# EAGLE schematic STM32F100 Base Wireless_1 (EAGLE 6.5.0)
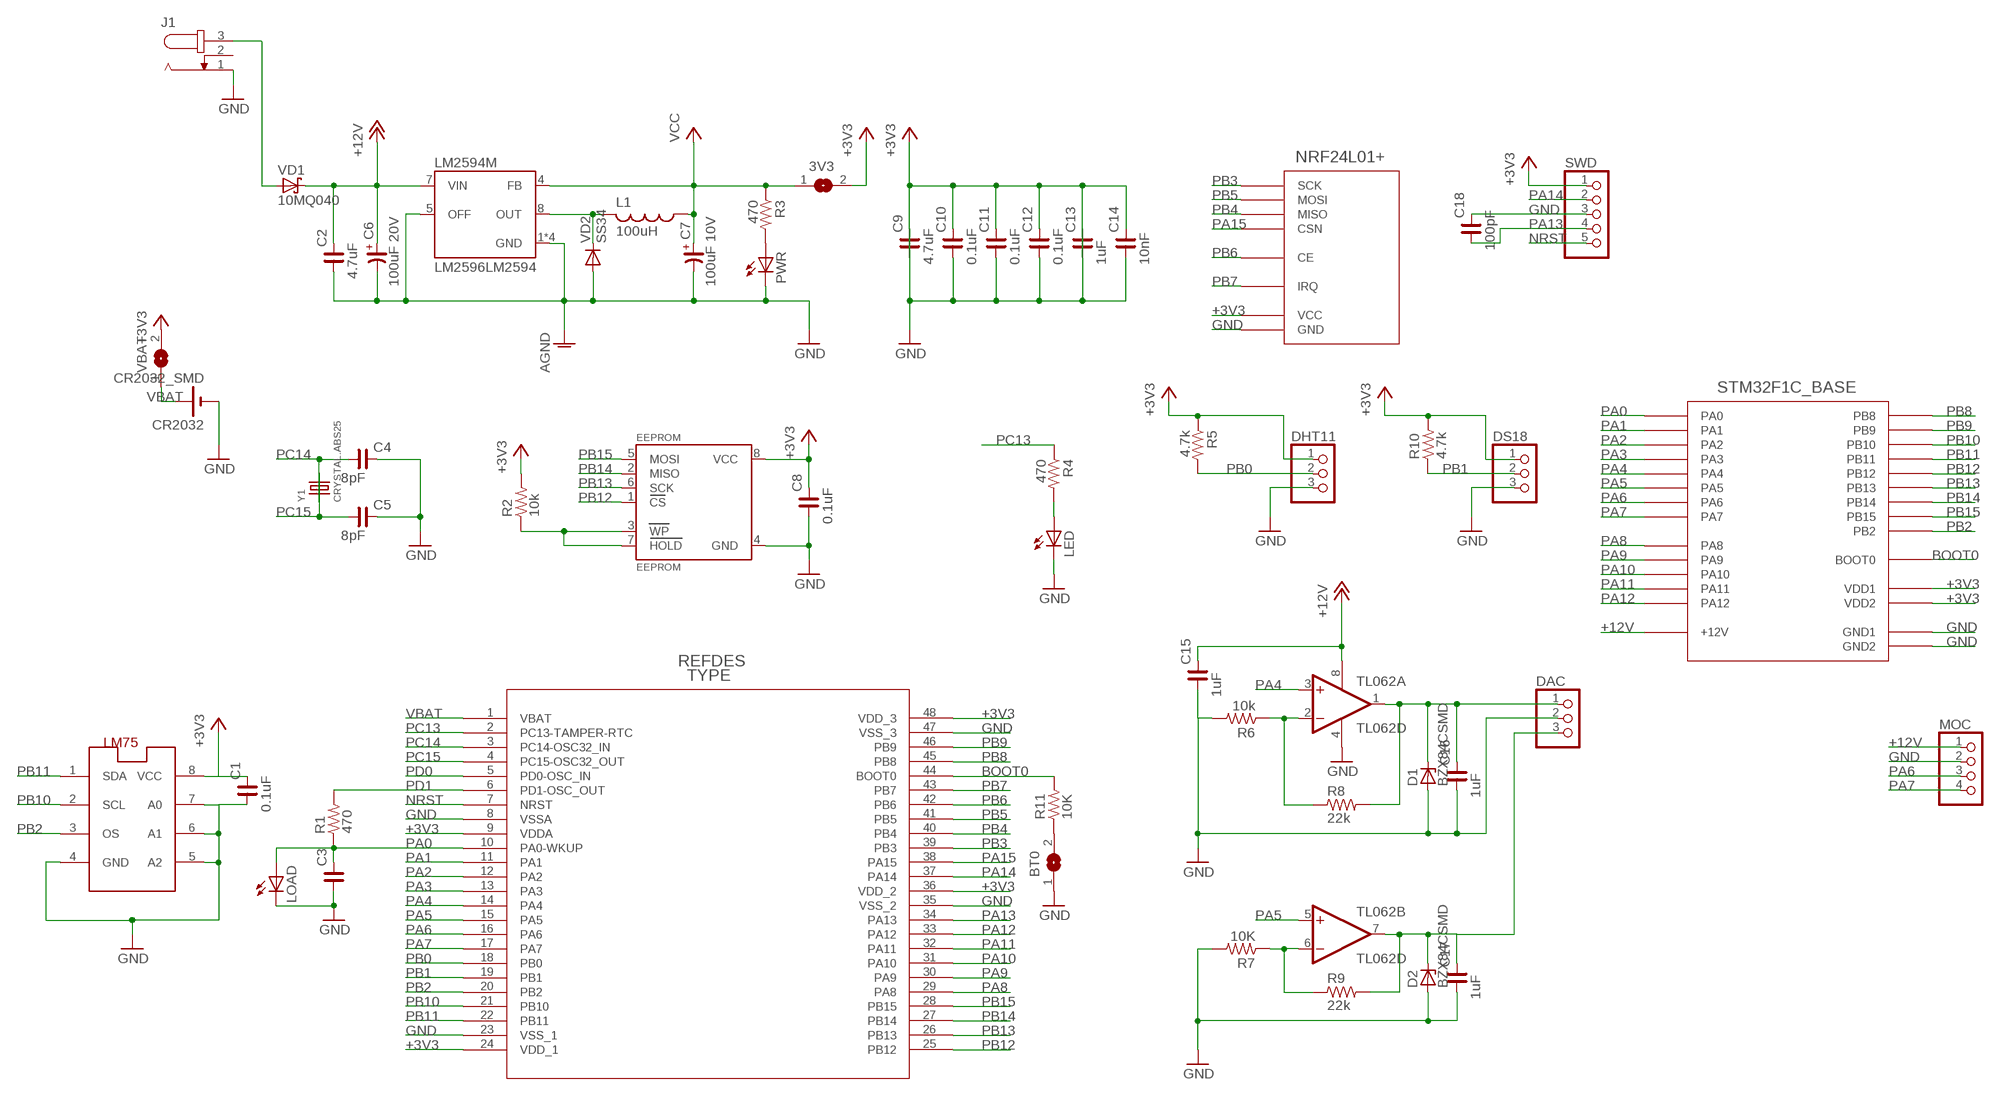
[diagram p0: schematic, sheet 1]

## Parts
3V3  SJ  [SJ]
BT0  SJ  [SJ]
C1  0.1uF  C_0603  [C0603]
C2  4.7uF  C_0603  [C0603]
C3  C_0603  [C0603]
C4  8pF  C_0603  [C0603]
C5  8pF  C_0603  [C0603]
C6  100uF 20V  CP_7343  [C7343/T]
C7  100uF 10V  CP_6032-28  [C6032-28/T]
C8  0.1uF  C_0603  [C0603]
C9  4.7uF  C_0603  [C0603]
C10  0.1uF  C_0603  [C0603]
C11  0.1uF  C_0603  [C0603]
C12  0.1uF  C_0603  [C0603]
C13  1uF  C_0603  [C0603]
C14  10nF  C_0603  [C0603]
C15  1uF  C_0603  [C0603]
C16  1uF  C_0603  [C0603]
C17  1uF  C_0603  [C0603]
C18  100pF  C_0603  [C0603]
CR2032  CR2032_SMD  [SMD_BH-2]
D1  BZX84CSMD  [TO236]
D2  BZX84CSMD  [TO236]
DAC  PINHD-1X03_2.54-S  [1X03-S]
DHT11  PINHD-1X03_2.54-S  [1X03-S]
DS18  PINHD-1X03_2.54-S  [1X03-S]
EEPROM  EEPROM  EEPROM_SPI_AT25040A  [SOIC8_150MIL]
J1  JACK-PLUG0  [SPC4077]
L1  100uH  L-USWE-TPC  [POWER-CHOKE_WE-TPC]
LED  LEDCHIPLED_1206  [CHIPLED_1206]
LM75  LM75_ICN  [SO8_LM75]
LM2594M  LM2596LM2594  [SOIC8_150MIL]
LOAD  LEDCHIPLED_1206  [CHIPLED_1206]
MOC  PINHD-1X04_2.54-S  [1X04-S]
NRF24L01+  NRF24L01+  [NRF24L01+]
PWR  LEDCHIPLED_1206  [CHIPLED_1206]
R1  470  R_1206  [R1206]
R2  10k  R_1206  [R1206]
R3  470  R_1206  [R1206]
R4  470  R_1206  [R1206]
R5  4.7k  R_1206  [R1206]
R6  10k  R_1206  [R1206]
R7  10K  R_1206  [R1206]
R8  22k  R_1206  [R1206]
R9  22k  R_1206  [R1206]
R10  4.7k  R_1206  [R1206]
R11  10K  R_1206  [R1206]
STM32F100C  STM32F100C8T6B  [LQFP-48]
SWD  PINHD-1X05_2.54-90°-S  [1X05/90-S]
TL062  TL062D  [SO08]
U$1  STM32F1C_BASE  [STM32F1_BASE]
VBAT  SJ  [SJ]
VD1  10MQ040  [SMA]
VD2  SS34  DIODE-DO214AC  [DO214AC]
Y1  CRYSTAL.ABS25  [ABS25]

## Nets
+3V3: 3V3.2 C1.2 C8.2 C9.1 C10.2 C11.2 C12.2 C13.1 C14.2 DHT11.1 DS18.1 EEPROM.8(VCC) LM75.8(VCC) NRF24L01+.VCC R2.2 R5.1 R10.2 STM32F100C.9(VDDA) STM32F100C.24(VDD_1) STM32F100C.36(VDD_2) STM32F100C.48(VDD_3) SWD.1 U$1.3.3(VDD1) U$1.3.3_1(VDD2) VBAT.2
+12V: C2.2 C6.+ C15.2 LM2594M.7(VIN) MOC.1 TL062.8(P:V+) U$1.+12(+12V) VD1.C
BOOT0: R11.2 STM32F100C.44(BOOT0) U$1.BOOT0
GND: BT0.1 C1.1 C2.1 C3.1 C4.2 C5.2 C6.- C7.- C8.1 C9.2 C10.1 C11.1 C12.1 C13.2 C14.1 C15.1 C16.1 C17.1 C18.2 CR2032.P$NEG(-) D1.A D2.A DAC.2 DHT11.3 DS18.3 EEPROM.4(GND) J1.1 LED.C LM75.4(GND) LM75.5(A2) LM75.6(A1) LM75.7(A0) LM2594M.1(GND) LM2594M.2(GND) LM2594M.3(GND) LM2594M.5(OFF) LM2594M.6(GND) LOAD.C MOC.2 NRF24L01+.GND PWR.C R6.2 R7.2 STM32F100C.8(VSSA) STM32F100C.23(VSS_1) STM32F100C.35(VSS_2) STM32F100C.47(VSS_3) SWD.3 TL062.4(P:V-) U$1.GND1(GND2) U$1.GND(GND1) VD2.A ; supply symbol labelled AGND
IN_12V: J1.3 VD1.A
LM_OUT: L1.2 LM2594M.8(OUT) VD2.C
LM_VCC: 3V3.1 C7.+ L1.1 LM2594M.4(FB) R3.1 ; supply symbol labelled VCC
N$1: C16.2 D1.C DAC.1 R8.2 TL062.1(A:OUT)
N$2: PWR.A R3.2
N$3: R6.1 R8.1 TL062.2(A:-IN)
N$4: R7.1 R9.1 TL062.6(B:-IN)
N$5: C17.2 D2.C DAC.3 R9.2 TL062.7(B:OUT)
N$6: LED.A R4.2
N$7: BT0.2 R11.1
N$10: EEPROM.3(WP) EEPROM.7(HOLD) R2.1
NRST: STM32F100C.7(NRST) SWD.5
PA0: C3.2 LOAD.A R1.1 STM32F100C.10(PA0-WKUP) U$1.PA0
PA1: STM32F100C.11(PA1) U$1.PA1
PA2: STM32F100C.12(PA2) U$1.PA2
PA3: STM32F100C.13(PA3) U$1.PA3
PA4: STM32F100C.14(PA4) TL062.3(A:+IN) U$1.PA4
PA5: STM32F100C.15(PA5) TL062.5(B:+IN) U$1.PA5
PA6: MOC.3 STM32F100C.16(PA6) U$1.PA6
PA7: MOC.4 STM32F100C.17(PA7) U$1.PA7
PA8: STM32F100C.29(PA8) U$1.PA8
PA9: STM32F100C.30(PA9) U$1.PA9
PA10: STM32F100C.31(PA10) U$1.PA10
PA11: STM32F100C.32(PA11) U$1.PA11
PA12: STM32F100C.33(PA12) U$1.PA12
PA13: C18.1 STM32F100C.34(PA13) SWD.4
PA14: STM32F100C.37(PA14) SWD.2
PA15: NRF24L01+.CSN STM32F100C.38(PA15)
PB0: DHT11.2 R5.2 STM32F100C.18(PB0)
PB1: DS18.2 R10.1 STM32F100C.19(PB1)
PB2: LM75.3(OS) STM32F100C.20(PB2) U$1.B2
PB3: NRF24L01+.SCK STM32F100C.39(PB3)
PB4: NRF24L01+.MISO STM32F100C.40(PB4)
PB5: NRF24L01+.MOSI STM32F100C.41(PB5)
PB6: NRF24L01+.CE STM32F100C.42(PB6)
PB7: NRF24L01+.IRQ STM32F100C.43(PB7)
PB8: STM32F100C.45(PB8) U$1.PB8
PB9: STM32F100C.46(PB9) U$1.PB9
PB10: LM75.2(SCL) STM32F100C.21(PB10) U$1.PB10
PB11: LM75.1(SDA) STM32F100C.22(PB11) U$1.PB11
PB12: EEPROM.1(CS) STM32F100C.25(PB12) U$1.PB12
PB13: EEPROM.6(SCK) STM32F100C.26(PB13) U$1.PB13
PB14: EEPROM.2(MISO) STM32F100C.27(PB14) U$1.PB14
PB15: EEPROM.5(MOSI) STM32F100C.28(PB15) U$1.PB15
PC13: R4.1 STM32F100C.2(PC13-TAMPER-RTC)
PC14: C4.1 STM32F100C.3(PC14-OSC32_IN) Y1.1
PC15: C5.1 STM32F100C.4(PC15-OSC32_OUT) Y1.4
PD0: STM32F100C.5(PD0-OSC_IN)
PD1: R1.2 STM32F100C.6(PD1-OSC_OUT)
VBAT: CR2032.P$POS1(+) STM32F100C.1(VBAT) VBAT.1
Unconnected: J1.2

## Library data of the parts
3V3 BT0 VBAT = jumper:SJ: SMD solder JUMPER
C1-C5 C8-C18 = rc-master-smd:C_: NON-POLARIZED CAP
C6 C7 = rc-master-smd:CP_: POLARIZED CAP
CR2032 = my-library:CR2032_SMD
D1 D2 = diode:BZX84CSMD: Z DIODE
DAC DHT11 DS18 = pinhead-2:PINHD-1X03: PIN HEADER
EEPROM = my-library:EEPROM_SPI_AT25040A: AT25010a/40a EEPROM SOIC8 AT25010a, 1K (128 x 8 bit) - Digikey: AT25010AN-10SU2.7-ND AT25040a, 4K (256 x 8 bit) - Digikey: AT25040AN-10SU1.8-ND TSSOP8 AT25010a, 1K (128 x 8 bit) - Digikey: AT25010A-10TU-1.8-ND AT25040a, 4K (256 x 8 bit) - Digikey: AT25040A-10TU-1.8-ND
J1 = con-jack:JACK-PLUG: DC POWER JACK Power Jack, DC, Right Angle, Through Hole, Rated 5A at 16VDC, PC Terminals Distributor: Farnell (www.Farnell.de) Drawing: 84N1161.pdf / 84N1162.pdf Manufacturer: SPC Technology (www.spctechnology.com) Type: SPC4077 / SPC 4078; OC_FARNELL: unknown; OC_NEWARK: unknown
L1 = rcl:L-US: INDUCTOR, American symbol; SDR0604-470KL: 47uH
LED LOAD PWR = led:LED: LED OSRAM: - CHIPLED LG R971, LG N971, LY N971, LG Q971, LY Q971, LO R971, LY R971 LH N974, LH R974 LS Q976, LO Q976, LY Q976 LO Q996 - Hyper CHIPLED LW Q18S LB Q993, LB Q99A, LB R99A - SideLED LS A670, LO A670, LY A670, LG A670, LP A670 LB A673, LV A673, LT A673, LW A673 LH A674 LY A675 LS A676, LA A676, LO A676, LY A676, LW A676 LS A679, LY A679, LG A679 - Hyper Micro SIDELED® LS Y876, LA Y876, LO Y876, LY Y876 LT Y87S - SmartLED LW L88C, LW L88S LB L89C, LB L89S, LG L890 LS L89K, LO L89K, LY L89K LS L896, LA L896, LO L896, LY L896 - TOPLED LS T670, LO T670, LY T670, LG T670, LP T670 LSG T670, LSP T670, LSY T670, LOP T670, LYG T670 LG T671, LOG T671, LSG T671 LB T673, LV T673, LT T673, LW T673 LH T674 LS T676, LA T676, LO T676, LY T676, LB T676, LH T676, LSB T676, LW T676 LB T67C, LV T67C, LT T67C, LS T67K, LO T67K, LY T67K, LW E67C LS E67B, LA E67B, LO E67B, LY E67B, LB E67C, LV E67C, LT E67C LW T67C LS T679, LY T679, LG T679 LS T770, LO T770, LY T770, LG T770, LP T770 LB T773, LV T773, LT T773, LW T773 LH T774 LS E675, LA E675, LY E675, LS T675 LS T776, LA T776, LO T776, LY T776, LB T776 LHGB T686 LT T68C, LB T68C - Hyper Mini TOPLED® LB M676 - Mini TOPLED Santana® LG M470 LS M47K, LO M47K, LY M47K Source: http://www.osram.convergy.de LUXEON: - LUMILED® LXK2-PW12-R00, LXK2-PW12-S00, LXK2-PW14-U00, LXK2-PW14-V00 LXK2-PM12-R00, LXK2-PM12-S00, LXK2-PM14-U00 LXK2-PE12-Q00, LXK2-PE12-R00, LXK2-PE12-S00, LXK2-PE14-T00, LXK2-PE14-U00 LXK2-PB12-K00, LXK2-PB12-L00, LXK2-PB12-M00, LXK2-PB14-N00, LXK2-PB14-P00, LXK2-PB14-Q00 LXK2-PR12-L00, LXK2-PR12-M00, LXK2-PR14-Q00, LXK2-PR14-R00 LXK2-PD12-Q00, LXK2-PD12-R00, LXK2-PD12-S00 LXK2-PH12-R00, LXK2-PH12-S00 LXK2-PL12-P00, LXK2-PL12-Q00, LXK2-PL12-R00 Source: www.luxeon.com KINGBRIGHT: KA-3528ASYC Source: www.kingbright.com
LM75 = lm75:LM75_IC: Temperatursensor
LM2594M = my-library:LM2596: LM2596
MOC = pinhead-2:PINHD-1X04: PIN HEADER
NRF24L01+ = my-library:NRF24L01+: NRF24L01+ wireless data transmission module 2.4G
R1-R11 = rc-master-smd:R_: RESISTOR
STM32F100C = STM32F1:STM32F100C8T6B
SWD = pinhead-2:PINHD-1X05: PIN HEADER
TL062 = linear:TL062: OP AMP
U$1 = my-library:STM32F1C_BASE: STM32F100C8 Base Board
VD1 = my-library:10MQ040: SCHOTTKY
VD2 = diode:DIODE-: DIODE
Y1 = abracon:CRYSTAL